# Altium project Lion-IRVT.PrjPcb (part 3 of 8)
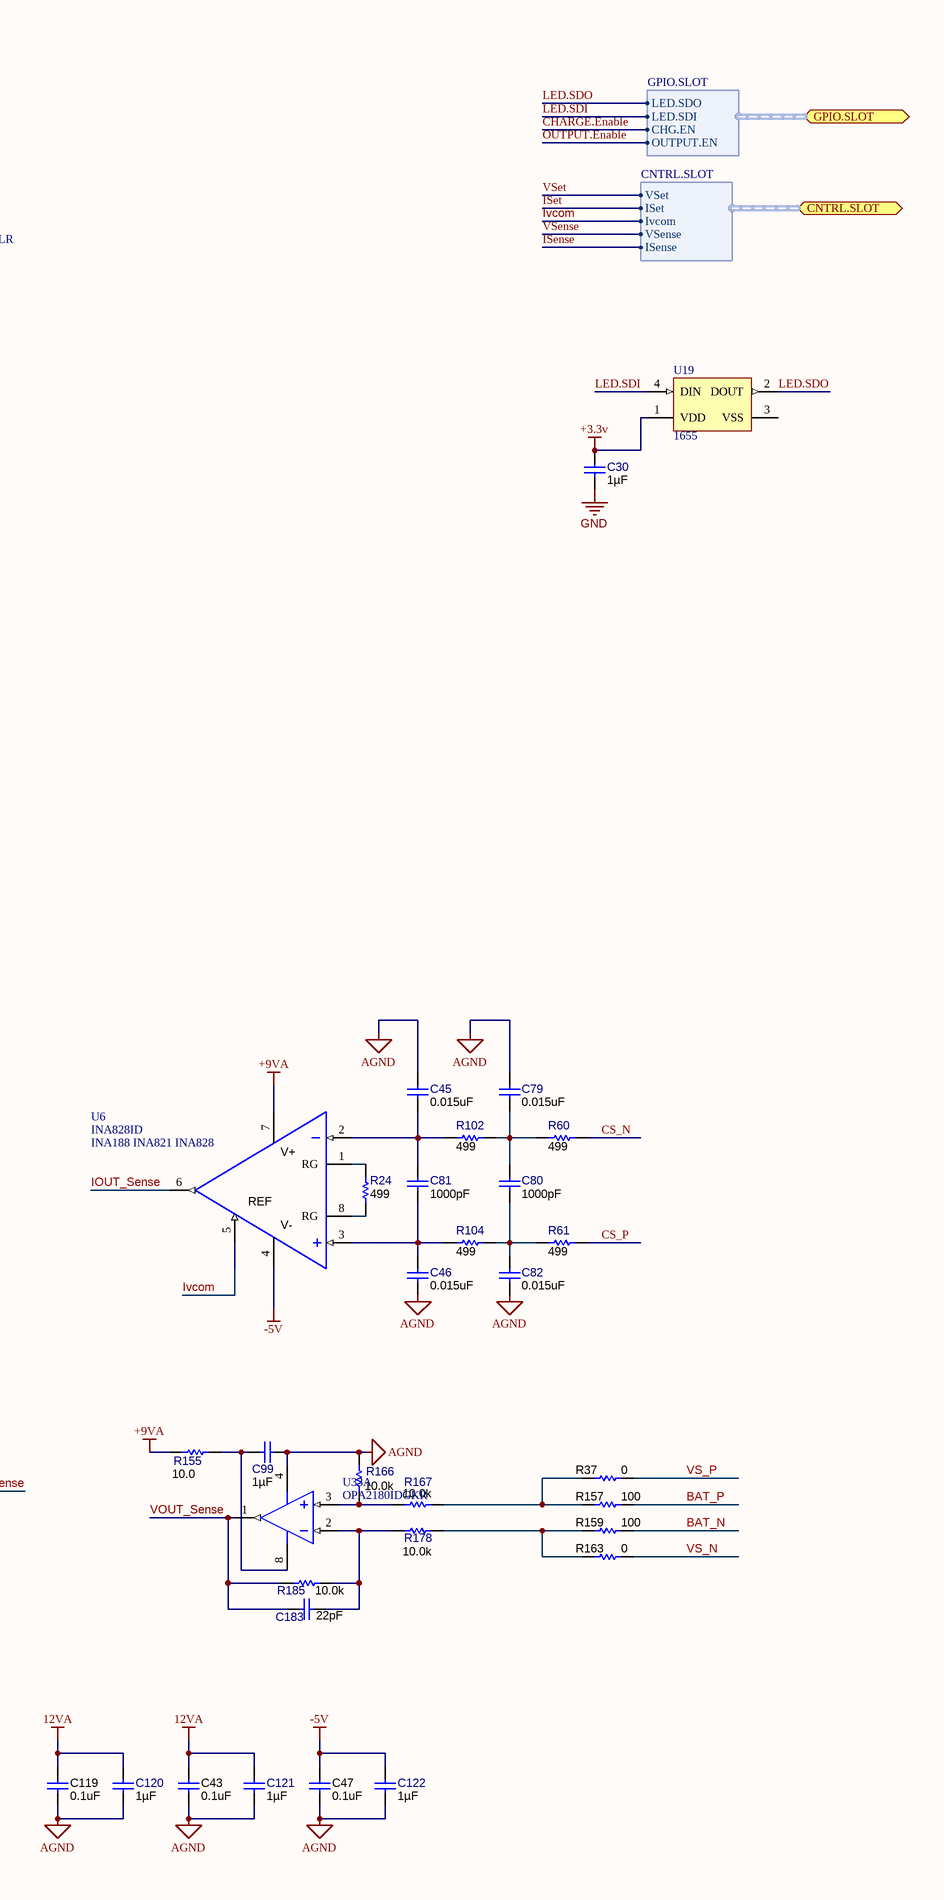
[diagram p103: LionIRVT-PMP40182.Control.SchDoc, right]

## Sheet LionIRVT-PMP40182.Control.SchDoc (continued)
### Library data of the parts
BN1 BP1 = ED555/2DS: Terminal Block, 6A, 3.5mm Pitch, 2-Pos, TH; Manufacturer: On-Shore Technology; SymbolCreator: a0412235; CompType: Connector; U/M: EA; SymbolVersion: 2013-03-14; PartNumber: ED555/2DS; RoHS: Y; PackageReference: 7.0x8.2x6.5mm; MountType: TH; ComponentLink1Description: Datasheet Link; ComponentLink1URL: http://on-shore.com/sites/default/files/manuals/ed555ds.pdf; Publisher: Texas Instruments; LatestRevisionDate: 2013-07-26; Supplier 1: Digi-Key; Supplier Part Number 1: ED1514-ND
C10 = 25SVPF330M: CAP, Aluminum Polymer, 330 µF, 25 V, +/- 20%, 0.014 ohm, F12, SMD, 2-Leads, Body 10.5x10.5mm, Height 12.7mm SMD; Manufacturer: Panasonic; Polarized: Y; CompType: Capacitor; Value: 330uF; U/M: EA; Cap_F: 0.00033; Tolerance_%: 20; VDC_V: 25; ESR_ohm: 0.014; IRMS_A: 5; TaMin_C: -55; TaMax_C: 105; SizeAreaWB_mm2: 151.29; SizeArea_mm2: 106.09; SizeX_mm: 10.3; SizeZ_mm: 12.6; AEC Category: Q200; AEC Qualified: N; SymbolVersion: 2008-07-09; PartNumber: 25SVPF330M; PackageReference: F12, SMD, 2-Leads, Body 10.5x10.5mm, Height 12.7mm; RoHS: Y; Value1: 0.014 ohm; MountType: SMT; Technology: Aluminum Polymer; Series: SVPF; Cap_Case: F12; SizeY_mm: 10.3; Publisher: Texas Instruments; LatestRevisionDate: 2016-12-22; ComponentLink1Description: Datasheet link; ComponentLink1URL: http://industrial.panasonic.com/www-data/pdf/AAB8000/AAB8000CE1.pdf; AEC Grade: N/A
C11 C12 = GRM32ER71E226KE15L: CAP, CERM, 22 µF, 25 V, +/- 10%, X7R, 1210; Manufacturer: MuRata; Polarized: N; CompType: Capacitor; Value: 22uF; U/M: EA; Cap_F: 0.000022; Tolerance_%: 10; Value1: Unknown; VDC_V: 25; TaMin_C: -55; TaMax_C: 125; Cap_Case: 1210; SizeArea_mm2: 8; SizeAreaWB_mm2: 14.7; SizeX_mm: 3.2; SizeY_mm: 2.5; SizeZ_mm: 2.7; AEC Category: Q200; SymbolVersion: 2008-07-09; PartNumber: GRM32ER71E226KE15L; PackageReference: 1210; RoHS: Y; MountType: SMT; Technology: Ceramic; TempCo: X7R; Published: 2008-06-19; Publisher: Texas Instruments; LatestRevisionDate: 2016-09-23; ComponentLink1Description: Datasheet link; ComponentLink1URL: http://search.murata.co.jp/Ceramy/PnsearchViewAction.do?HnOFG=ON&HnNFG=ON&SEL_CNT=50&sLang=en&sKey=GRM32ER71E226KE15L&x=9&y=9&search=startwith; Supplier 1: Digi-Key; Supplier Part Number 1: 490-5313-1-ND; Supplier 2: Mouser; Supplier Part Number 2: 81-GRM32ER71E226KE5L; Supplier 3: Farnell; Supplier Part Number 3: 1797019; AEC Qualified: ?
C17 C20 = GRM32ER71A476ME15L: CAP, CERM, 47 µF, 10 V, +/- 20%, X7R, 1210; Manufacturer: MuRata; Polarized: N; CompType: Capacitor; Value: 47uF; U/M: EA; Cap_F: 0.000047; Tolerance_%: 20; Value1: Unknown; VDC_V: 10; TaMin_C: -55; TaMax_C: 125; Cap_Case: 1210; SizeArea_mm2: 8; SizeAreaWB_mm2: 14.7; SizeX_mm: 3.2; SizeY_mm: 2.5; SizeZ_mm: 2.7; AEC Category: Q200; SymbolVersion: 2008-07-09; PartNumber: GRM32ER71A476ME15L; PackageReference: 1210; RoHS: Y; MountType: SMT; Technology: Ceramic; TempCo: X7R; Published: 2008-06-19; Publisher: Texas Instruments; LatestRevisionDate: 2016-09-23; ComponentLink1Description: Datasheet link; ComponentLink1URL: http://search.murata.co.jp/Ceramy/image/img/A01X/G101/ENG/GRM32ER71A476ME15-01.pdf; Supplier 1: Digi-Key; Supplier Part Number 1: 490-6543-1-ND; Supplier 2: Mouser; Supplier Part Number 2: 81-GRM32ER71A476ME5L; Supplier 3: Farnell; Supplier Part Number 3: 2362130; AEC Qualified: ?
C24 = 10SVP560M: CAP, Aluminum Polymer, 560 µF, 10 V, +/- 20%, 0.013 ohm, 10x10.3 SMD; Manufacturer: Panasonic; Polarized: Y; CompType: Capacitor; Value: 560uF; U/M: EA; Cap_F: 0.00056; Tolerance_%: 20; VDC_V: 10; ESR_ohm: 0.013; IRMS_A: 5.23; TaMin_C: -55; TaMax_C: 105; Cap_Case: 10.3x10.3x12.6; SizeAreaWB_mm2: 159.9; SizeArea_mm2: 113.3; SizeX_mm: 11; SizeY_mm: 10.3; SizeZ_mm: 7.7; AEC Category: Q200; SymbolVersion: 2008-07-09; PartNumber: 10SVP560M; PackageReference: 10x10.3; RoHS: Y; Value1: 0.013 ohm; MountType: SMT; Technology: Aluminum Polymer; Series: SVP; Publisher: Texas Instruments; LatestRevisionDate: 2016-09-20; ComponentLink1Description: Datasheet link; ComponentLink1URL: https://industrial.panasonic.com/content/data/CP/PDF/OS-CON/S_OS-CON_SVP_e.pdf; AEC Qualified: ?
C30 C85 C88 C97 C99 C101 C120-C122 C169 C171 = C0603C105K3RACTU: CAP, CERM, 1 µF, 25 V, +/- 10%, X7R, 0603; Manufacturer: Kemet; Polarized: N; CompType: Capacitor; Value: 1uF; U/M: EA; Cap_F: 0.000001; Tolerance_%: 10; Value1: Unknown; VDC_V: 25; Value2: 25V; TaMin_C: -55; TaMax_C: 125; Cap_Case: 0603; SizeArea_mm2: 1.28; SizeAreaWB_mm2: 4.68; SizeX_mm: 1.6; SizeY_mm: 0.8; SizeZ_mm: 1; AEC Category: Q200; SymbolVersion: 2008-07-09; PartNumber: C0603C105K3RACTU; PackageReference: 0603; RoHS: Y; MountType: SMT; Technology: Ceramic; TempCo: X7R; Published: 2008-06-19; Publisher: Texas Instruments; LatestRevisionDate: 2016-09-23; ComponentLink1Description: Datasheet link; ComponentLink1URL: http://capacitoredge.kemet.com/capedge2/DataSheet/Datasheet-C0603C105K3RACTU.pdf?pn=C0603C105K3RACTU; Supplier 1: Digi-Key; Supplier Part Number 1: 399-7376-1-ND; Supplier 2: Mouser; Supplier Part Number 2: 80-C0603C105K3R; Supplier 3: Farnell; Supplier Part Number 3: 2118128; AEC Qualified: ?
C43 C47 C56 C86 C119 C167 = CMP-0006752-5: CAP, CERM, 0.1 uF, 25 V, +/- 5%, X7R, 0603; PartNumber: 06033C104JAT2A; Manufacturer: AVX; Polarized: N; Value: 0.1uF; U/M: EA; Cap_F: 100nF; ESR_ohm: 0.05; Value1: 0.05 ohm; VDC_V: 25V; TaMin_C: -55°C; TaMax_C: 125°C; Cap_Case: 0603; AEC Category: Q200; SizeArea_mm2: 1.28; SizeAreaWB_mm2: 4.68; SizeX_mm: 1.6; SizeY_mm: 0.8; SizeZ_mm: 1; CompType: Capacitor; PackageReference: 0603; RoHS: Y; Tolerance_%: 5%; Value2: 25V; MountType: SMT; Technology: Ceramic; TempCo: X7R; Published: 2008-06-19; Publisher: Texas Instruments; LatestRevisionDate: 2017-03-09; ComponentLink1Description: Datasheet link; ComponentLink1URL: http://datasheets.avx.com/X7RDielectric.pdf; Supplier 1: Digi-Key; Supplier Part Number 1: 478-3713-1-ND; Supplier 2: Mouser; Supplier Part Number 2: 581-06033C104JAT2A; Supplier 3: Farnell; Supplier Part Number 3: 1740614; AEC Qualified: N; AEC Grade: N/A
C45 C46 C79-C82 = CMP-0007383-5: CAP, CERM, 0.015 uF, 16 V, +/- 10%, X7R, 0603; PartNumber: GRM188R71C153KA01D; Manufacturer: MuRata; Polarized: N; U/M: EA; Cap_F: 15nF; Value1: Unknown; VDC_V: 16V; TaMin_C: -55°C; TaMax_C: 125°C; Cap_Case: 0603; SizeArea_mm2: 1.28; SizeAreaWB_mm2: 4.68; SizeX_mm: 1.6; SizeY_mm: 0.8; SizeZ_mm: 1; AEC Category: Q200; CompType: Capacitor; Value: 0.015uF; PackageReference: 0603; RoHS: Y; Tolerance_%: 10%; Value2: 16V; MountType: SMT; Technology: Ceramic; TempCo: X7R; Published: 2008-06-19; Publisher: Texas Instruments; LatestRevisionDate: 2017-03-09; ComponentLink1Description: Datasheet link; ComponentLink1URL: http://search.murata.co.jp/Ceramy/PnsearchViewAction.do?HnOFG=ON&HnNFG=ON&SEL_CNT=50&sLang=en&sKey=GRM188R71C153KA01D&x=9&y=9&search=startwith; Supplier 1: Mouser; Supplier Part Number 1: 81-GRM188R71C153KA; AEC Qualified: ?
C48 = GRM319R61H475KA12: CAP, CERM, 4.7 µF, 50 V, +/- 10%, X5R, 1206; Manufacturer: MuRata; Polarized: N; CompType: Capacitor; Value: 4.7uF; U/M: EA; Cap_F: 0.0000047; Tolerance_%: 10; Value1: Unknown; VDC_V: 50; TaMin_C: -55; TaMax_C: 85; Cap_Case: 1206; SizeArea_mm2: 5.12; SizeAreaWB_mm2: 10.92; SizeX_mm: 3.2; SizeY_mm: 1.6; SizeZ_mm: 1.35; AEC Category: Q200; SymbolVersion: 2008-07-09; PartNumber: GRM319R61H475KA12; PackageReference: 1206; RoHS: Y; MountType: SMT; Technology: Ceramic; TempCo: X5R; Published: 2008-06-19; Publisher: Texas Instruments; LatestRevisionDate: 2016-09-23; ComponentLink1Description: Datasheet link; ComponentLink1URL: http://psearch.murata.com/capacitor/product/GRM319R61H475KA12%23.pdf; Supplier 1: Farnell; Supplier Part Number 1: 1845761; Supplier 2: Newark; Supplier Part Number 2: 13T1225; AEC Qualified: ?
C55 C89-C91 C95 C96 C100 C166 = GRM1885C1H101JA01D: CAP, CERM, 100 pF, 50 V, +/- 5%, C0G/NP0, 0603; Manufacturer: MuRata; Polarized: N; CompType: Capacitor; Value: 100pF; U/M: EA; Cap_F: 0.0000000001; Tolerance_%: 5; Value1: Unknown; VDC_V: 50; Value2: 50V; TaMin_C: -55; TaMax_C: 125; Cap_Case: 0603; SizeArea_mm2: 1.28; SizeAreaWB_mm2: 4.68; SizeX_mm: 1.6; SizeY_mm: 0.8; SizeZ_mm: 1; AEC Category: Q200; SymbolVersion: 2008-07-09; PartNumber: GRM1885C1H101JA01D; PackageReference: 0603; RoHS: Y; MountType: SMT; Technology: Ceramic; TempCo: C0G/NP0; Published: 2008-06-19; Publisher: Texas Instruments; ComponentLink1Description: Datasheet link; ComponentLink1URL: http://search.murata.co.jp/Ceramy/PnsearchViewAction.do?HnOFG=ON&HnNFG=ON&SEL_CNT=50&sLang=en&sKey=GRM1885C1H101JA01D&x=9&y=9&search=startwith; Supplier 1: Digi-Key; Supplier Part Number 1: 490-1427-1-ND; Supplier 2: Mouser; Supplier Part Number 2: 81-GRM39C101J50; Supplier 3: Farnell; Supplier Part Number 3: 8819866; AEC Qualified: ?
  C55 C89-C91 C95 C96 C100: LatestRevisionDate: 2016-09-23
  C166: LatestRevisionDate: 2016-12-20
C74 C168 C177 = GRM1885C1H103JA01D: CAP, CERM, 0.01 µF, 50 V, +/- 5%, C0G/NP0, 0603; Manufacturer: MuRata; Polarized: N; CompType: Capacitor; Value: 0.01uF; U/M: EA; Cap_F: 0.00000001; Tolerance_%: 5; Value1: Unknown; VDC_V: 50; Value2: 50V; TaMin_C: -55; TaMax_C: 125; Cap_Case: 0603; SizeArea_mm2: 1.28; SizeAreaWB_mm2: 4.68; SizeX_mm: 1.6; SizeY_mm: 0.8; SizeZ_mm: 1; AEC Category: Q200; SymbolVersion: 2008-07-09; PartNumber: GRM1885C1H103JA01D; PackageReference: 0603; RoHS: Y; MountType: SMT; Technology: Ceramic; TempCo: C0G/NP0; Published: 2008-06-19; Publisher: Texas Instruments; LatestRevisionDate: 2017-03-17; ComponentLink1Description: Datasheet link; ComponentLink1URL: http://search.murata.co.jp/Ceramy/image/img/A01X/G101/ENG/GRM1885C1H103JA01-01.pdf; Supplier 1: Digi-Key; Supplier Part Number 1: 490-9666-1-ND; Supplier 2: Newark; Supplier Part Number 2: 31Y1764; Supplier 3: Mouser; Supplier Part Number 3: 81-GRM1885C1H103JA1D; AEC Qualified: N; AEC Grade: N/A
C87 = GRM1885C1H102JA01D: CAP, CERM, 1000 pF, 50 V, +/- 5%, C0G/NP0, 0603; Manufacturer: MuRata; Polarized: N; CompType: Capacitor; Value: 1000pF; U/M: EA; Cap_F: 0.000000001; Tolerance_%: 5; Value1: Unknown; VDC_V: 50; Value2: 50V; TaMin_C: -55; TaMax_C: 125; Cap_Case: 0603; SizeArea_mm2: 1.28; SizeAreaWB_mm2: 4.68; SizeX_mm: 1.6; SizeY_mm: 0.8; SizeZ_mm: 1; AEC Category: Q200; SymbolVersion: 2008-07-09; PartNumber: GRM1885C1H102JA01D; PackageReference: 0603; RoHS: Y; MountType: SMT; Technology: Ceramic; TempCo: C0G/NP0; Published: 2008-06-19; Publisher: Texas Instruments; LatestRevisionDate: 2016-09-23; ComponentLink1Description: Datasheet link; ComponentLink1URL: http://search.murata.co.jp/Ceramy/PnsearchViewAction.do?HnOFG=ON&HnNFG=ON&SEL_CNT=50&sLang=en&sKey=GRM1885C1H102JA01D&x=9&y=9&search=startwith; Supplier 1: Digi-Key; Supplier Part Number 1: 490-1451-1-ND; Supplier 2: Mouser; Supplier Part Number 2: 81-GRM39C102J50; Supplier 3: Farnell; Supplier Part Number 3: 8819920; AEC Qualified: ?
C92 = GRM188R71A225KE15D: CAP, CERM, 2.2 µF, 10 V, +/- 10%, X7R, 0603; Manufacturer: MuRata; Polarized: N; CompType: Capacitor; Value: 2.2uF; U/M: EA; Cap_F: 0.0000022; Tolerance_%: 10; ESR_ohm: 0.009; Value1: 0.009 ohm; Value2: 10V; TaMin_C: -55; TaMax_C: 125; Cap_Case: 0603; SizeArea_mm2: 1.28; SizeAreaWB_mm2: 4.68; SizeX_mm: 1.6; SizeY_mm: 0.8; SizeZ_mm: 1; AEC Category: Q200; SymbolVersion: 2008-07-09; PartNumber: GRM188R71A225KE15D; PackageReference: 0603; RoHS: Y; VDC_V: 10; MountType: SMT; Technology: Ceramic; TempCo: X7R; Published: 2008-06-19; Publisher: Texas Instruments; LatestRevisionDate: 2017-03-17; ComponentLink1Description: Datasheet link; ComponentLink1URL: http://search.murata.co.jp/Ceramy/PnsearchViewAction.do?HnOFG=ON&HnNFG=ON&SEL_CNT=50&sLang=en&sKey=GRM188R71A225KE15D&x=9&y=9&search=startwith; Supplier 1: Digi-Key; Supplier Part Number 1: 490-4520-1-ND; Supplier 2: Mouser; Supplier Part Number 2: 81-GRM188R71A225KE15; Supplier 3: Farnell; Supplier Part Number 3: 1797012; AEC Qualified: ?
C93 C170 = GRM1885C1H221JA01D: CAP, CERM, 220 pF, 50 V, +/- 5%, C0G/NP0, 0603; Manufacturer: MuRata; Polarized: N; CompType: Capacitor; Value: 220pF; U/M: EA; Cap_F: 0.00000000022; Tolerance_%: 5; Value1: Unknown; VDC_V: 50; Value2: 50V; TaMin_C: -55; TaMax_C: 125; Cap_Case: 0603; SizeArea_mm2: 1.28; SizeAreaWB_mm2: 4.68; SizeX_mm: 1.6; SizeY_mm: 0.8; SizeZ_mm: 1; AEC Category: Q200; SymbolVersion: 2008-07-09; PartNumber: GRM1885C1H221JA01D; PackageReference: 0603; RoHS: Y; MountType: SMT; Technology: Ceramic; TempCo: C0G/NP0; Published: 2008-06-19; Publisher: Texas Instruments; ComponentLink1Description: Datasheet link; ComponentLink1URL: http://search.murata.co.jp/Ceramy/PnsearchViewAction.do?HnOFG=ON&HnNFG=ON&SEL_CNT=50&sLang=en&sKey=GRM1885C1H221JA01D&x=9&y=9&search=startwith; Supplier 1: Digi-Key; Supplier Part Number 1: 490-1435-1-ND; Supplier 2: Mouser; Supplier Part Number 2: 81-GRM39C221J50; Supplier 3: Farnell; Supplier Part Number 3: 8819882; AEC Qualified: ?
  C93: LatestRevisionDate: 2017-03-10
  C170: LatestRevisionDate: 2017-03-17
C98 = C0603C104J3RACTU: CAP, CERM, 0.1 µF, 25 V, +/- 5%, X7R, 0603; Manufacturer: Kemet; Polarized: N; CompType: Capacitor; Value: 0.1uF; U/M: EA; Cap_F: 0.0000001; Tolerance_%: 5; Value1: Unknown; VDC_V: 25; Value2: 25V; TaMin_C: -55; TaMax_C: 125; Cap_Case: 0603; SizeArea_mm2: 1.28; SizeAreaWB_mm2: 4.68; SizeX_mm: 1.6; SizeY_mm: 0.8; SizeZ_mm: 1; AEC Category: Q200; SymbolVersion: 2008-07-09; PartNumber: C0603C104J3RACTU; PackageReference: 0603; RoHS: Y; MountType: SMT; Technology: Ceramic; TempCo: X7R; Published: 2008-06-19; Publisher: Texas Instruments; LatestRevisionDate: 2016-09-23; ComponentLink1Description: Datasheet link; ComponentLink1URL: http://www.kemet.com/kemet/web/homepage/kechome.nsf/vapubfiles/F3102_Y5V.pdf/$file/F3102_Y5V.pdf; Supplier 1: Digi-Key; Supplier Part Number 1: 399-1282-1-ND; Supplier 2: Mouser; Supplier Part Number 2: 80-C0603C104J3R; Supplier 3: Farnell; Supplier Part Number 3: 1650833; AEC Qualified: ?
C118 = GRM188R71A334KA61D: CAP, CERM, 0.33 µF, 10 V, +/- 10%, X7R, 0603; Manufacturer: MuRata; Polarized: N; CompType: Capacitor; Value: 0.33uF; U/M: EA; Cap_F: 0.00000033; Tolerance_%: 10; Value1: Unknown; Value2: 10V; TaMin_C: -55; TaMax_C: 125; Cap_Case: 0603; SizeArea_mm2: 1.28; SizeAreaWB_mm2: 4.68; SizeX_mm: 1.6; SizeY_mm: 0.8; SizeZ_mm: 1; AEC Category: Q200; SymbolVersion: 2008-07-09; PartNumber: GRM188R71A334KA61D; PackageReference: 0603; RoHS: Y; VDC_V: 10; MountType: SMT; Technology: Ceramic; TempCo: X7R; Published: 2008-06-19; Publisher: Texas Instruments; LatestRevisionDate: 2017-03-17; ComponentLink1Description: Datasheet link; ComponentLink1URL: http://search.murata.co.jp/Ceramy/PnsearchViewAction.do?HnOFG=ON&HnNFG=ON&SEL_CNT=50&sLang=en&sKey=GRM188R71A334KA61D&x=9&y=9&search=startwith; Supplier 1: Digi-Key; Supplier Part Number 1: GRM188R71A334KA61D-ND; Supplier 2: Mouser; Supplier Part Number 2: 81-GRM188R71A334KA1D; AEC Qualified: ?
C124 = CMP-03020-023900-1: CAP CER 1500PF 100V NP0 0603; Manufacturer: KEMET; Material: Ceramic; Automotive Grade: Grade 1; Temperature Characteristic: C0G; Value: 1,500 pF; Tolerance: 0.05; Temperature Coefficient: 30ppm/°C; Manufacturer Part Number: C0603C152J1GACTU; ComponentLink2URL: https://api.kemet.com/component-edge/download/datasheet/C0603C100J5GACAUTO.pdf; ComponentLink2Description: Datasheet; Package: C0603C-CF; Octopart: https://octopart.com/c0603c152j1gactu-kemet-12793172; Lead Free: Yes; Temperature Range Low: -55°C; Digikey Description: CAP CER 1500PF 100V NP0 0603; Height: 0.87mm; Device Class L1: Passive Components; Mouser Description: Cap Ceramic 0.0015uF 100V C0G 5% SMD 0603 125°C Paper T/R; Voltage Rating: 100 V; Device Class L2: Capacitors; Category: Cap; Device Class L3: Ceramic Capacitors; Automotive: Yes; Temperature: -55°C to +125°C; Temperature Range High: +125°C; RoHS: TRUE
C183 = C0603C220J5GACTU: CAP, CERM, 22 pF, 50 V, +/- 5%, C0G/NP0, 0603; Manufacturer: Kemet; Polarized: N; CompType: Capacitor; Value: 22pF; U/M: EA; Cap_F: 0.000000000022; Tolerance_%: 5; Value1: Unknown; VDC_V: 50; Value2: 50V; TaMin_C: -55; TaMax_C: 125; Cap_Case: 0603; SizeArea_mm2: 1.28; SizeAreaWB_mm2: 4.68; SizeX_mm: 1.6; SizeY_mm: 0.8; SizeZ_mm: 1; AEC Category: Q200; SymbolVersion: 2008-07-09; PartNumber: C0603C220J5GACTU; PackageReference: 0603; RoHS: Y; MountType: SMT; Technology: Ceramic; TempCo: C0G/NP0; Published: 2008-06-19; Publisher: Texas Instruments; LatestRevisionDate: 2016-09-23; ComponentLink1Description: Datasheet link; ComponentLink1URL: http://www.kemet.com/kemet/web/homepage/kechome.nsf/vapubfiles/F3102_Y5V.pdf/$file/F3102_Y5V.pdf; Supplier 1: Digi-Key; Supplier Part Number 1: 399-1053-1-ND; Supplier 2: Mouser; Supplier Part Number 2: 80-C0603C220J5G; Supplier 3: Farnell; Supplier Part Number 3: 1414622; AEC Qualified: ?
D1 D7 = MBR140SFT1G: Diode, Schottky, 40 V, 1 A, SOD-123FL; Manufacturer: ON Semiconductor; U/M: EA; Vf_V: 0.55; Value: 40V; Value1: 1A; Value2: 0.55V; Io_A: 1; Vr_V: 40; TJmax_C: 125; RJC_CperW: 26; SizeAreaWB_mm2: 12.19; SizeArea_mm2: 5.94; SizeX_mm: 3.6; SizeY_mm: 1.65; SizeZ_mm: 0.98; AEC Category: Q101; SymbolVersion: 2008-12-08; PartNumber: MBR140SFT1G; PackageReference: SOD-123FL; CompType: Diode; MountType: SMT; Type: Schottky; RoHS: Y; Published: 2008-06-26; Publisher: Texas Instruments; LatestRevisionDate: 2016-12-16; ComponentLink1Description: Datasheet link; ComponentLink1URL: http://www.onsemi.com/pub_link/Collateral/MBR140SFT1-D.PDF; Supplier 1: Digi-Key; Supplier Part Number 1: MBR140SFT1GOSCT-ND; Supplier 2: Mouser; Supplier Part Number 2: 863-MBR140SFT1G; Supplier 3: Farnell; Supplier Part Number 3: 1431046; AEC Qualified: ?
D2 D8-D12 D16-D18 = NSR0240V2T1G: Diode, Schottky, 40V, 0.25A, SOD-523; Manufacturer: ON Semiconductor; U/M: EA; Vf_V: 0.7; Value2: 0.7V; Io_A: 0.25; Vr_V: 40; TJmax_C: 150; RJC_CperW: 600; CompType: Diode; SymbolVersion: 2008-12-08; PartNumber: NSR0240V2T1G; PackageReference: SOD-523; Value: 40V; Value1: 0.25A; MountType: SMT; Type: Schottky; RoHS: Y; Published: 2008-06-26; Publisher: Texas Instruments; LatestRevisionDate: 2014-07-21; ComponentLink1Description: Datasheet link; ComponentLink1URL: http://www.onsemi.com/pub_link/Collateral/NSR0240V2T1-D.PDF; Supplier 1: Digi-Key; Supplier Part Number 1: NSR0240V2T1GOSCT-ND; Supplier 2: Mouser; Supplier Part Number 2: 863-NSR0240V2T1G; Supplier 3: Newark; Supplier Part Number 3: 46P8323
D4 D5 = MMSZ5245BS-7-F: Diode, Zener, 15 V, 200 mW, SOD-323; Manufacturer: Diodes Inc.; SymbolCreator: a0412235; U/M: EA; Power_W: 0.2; Vz_V: 15; Value1: 0.2W; RJA_CperW: 350; SizeAreaWB_mm2: 8.695; SizeArea_mm2: 3.645; SizeX_mm: 2.7; SizeY_mm: 1.35; SizeZ_mm: 1; AEC Category: Q101; SymbolVersion: 2010-08-25; PartNumber: MMSZ5245BS-7-F; PackageReference: SOD-323; CompType: Zener; Vr_V: N/A; MountType: SMT; RoHS: Y; ComponentLink1Description: Datasheet link; ComponentLink1URL: http://www.diodes.com/datasheets/ds31038.pdf; Published: 2008-10-08; Publisher: Texas Instruments; LatestRevisionDate: 2017-03-18; LatestRevisionNote: Updated Supplier Data; Supplier 1: Digi-Key; Supplier Part Number 1: MMSZ5245BS-FDICT-ND; Supplier 2: Mouser; Supplier Part Number 2: 621-MMSZ5245BS-F; AEC Qualified: ?
D15 = MMSZ5233BS-7-F: Diode, Zener, 6 V, 200 mW, SOD-323; Manufacturer: Diodes Inc.; U/M: EA; Value1: 0.2W; SymbolCreator: a0412235; Power_W: 0.2; Vz_V: 6; RJA_CperW: 350; SizeAreaWB_mm2: 8.695; SizeArea_mm2: 3.645; SizeX_mm: 2.7; SizeY_mm: 1.35; SizeZ_mm: 1; AEC Category: Q101; CompType: Zener; SymbolVersion: 2010-08-25; PartNumber: MMSZ5233BS-7-F; PackageReference: SOD-323; Value: 6V; Vr_V: N/A; MountType: SMT; RoHS: Y; Published: 2008-10-08; Publisher: Texas Instruments; LatestRevisionDate: 2017-03-18; ComponentLink1Description: Datasheet link; ComponentLink1URL: http://www.diodes.com/datasheets/ds31038.pdf; Supplier 1: Digi-Key; Supplier Part Number 1: MMSZ5233BS-FDICT-ND; Supplier 2: Mouser; Supplier Part Number 2: 621-MMSZ5233BS-7-F; LatestRevisionNote: Updated Supplier Data; AEC Qualified: ?
F1 = FUSE_CCF1N_SERIES: Fuse, Fast Acting, 50VDC, 20A; Manufacturer: Koanet; Area: 46035; Value: LH-10; ComponentLink1URL: \\vette02\pmp_pcb\pcad_pdf's\ccf_fuse.pdf; ComponentHeight: 0.098 inch; PackageReference: 0.98 x 0.236 inch; SymbolVersion: 07/31/2009 12:17:29; PartNumber: CCF1N15; ComponentLink1Description: AEO Datasheet Link
L4 = CMP-0226-00120-1: SMD High Current Cube Inductor WE-HCC, L=3.30 µH; Inductance: 3.30 ÂµH; ComponentLink1URL: http://www.we-online.com; PackageVersion: 2009; DatasheetVersion: ver 2, Nov-2009; ComponentLink2Description: Datasheet; PackageDescription: Inductor, 2-Leads, Body 12.1 x 11.4 mm; ComponentLink2URL: http://www.we-online.de/katalog/media/pdf/7443320330.pdf; ComponentLink1Description: Manufacturer Link; PackageReference: WE-HCC-1210
Q4 Q5 = CSD16570Q5B: 25V, N ch NexFET MOSFET™, single SON5x6, 0.82mOhm; Manufacturer: Texas Instruments; Manufacturer Part Number: CSD16570Q5BT; CompType: MOSFET; Continuous Drain Current (ID): 100A; Rds On Max: 0.59mR; Input Capacitance: 14nF; Max Power Dissipation: 195W; Gate to Source Voltage (Vgs): 20V; Fall Time: 72ns; Rise Time: 43ns; Turn-Off Delay Time: 156ns; Turn-On Delay Time: 5ns; Threshold Voltage: 1.5V; Number of Channels: 1; SymbolVersion: 2008-07-09; Value: 25V; PartNumber: CSD16570Q5B; PackageReference: DNK0008A; ComponentLink1Description: Datasheet link; ComponentLink1URL: http://www.ti.com/lit/ds/symlink/csd17308q3.pdf; Supplier 1: Digi-Key; RoHS: Yes; Category: MOSFETs; Stock 1: 3774; Pricing 1: 1=2.43000, 10=2.18600, 25=2.06240, 100=1.60880 (USD); Mount: Surface Mount; Number of Pins: 8; Weight: 0.000847oz; Contact Plating: Gold; Min Operating Temperature: -55°C; Max Operating Temperature: 150°C; Packaging: Tape and Reel; Drain to Source Voltage (Vdss): 25V; Element Configuration: Single; Drain to Source Breakdown Voltage: 25V; Package Quantity: 250; Lead Free: Contains Lead; REACH SVHC: No SVHC; ComponentLink2URL: http://www.farnell.com/datasheets/1874868.pdf?src-supplier=Farnell; ComponentLink2Description: http://www.farnell.com/datasheets/1874868.pdf?src-supplier=Farnell; ComponentLink3URL: http://www.farnell.com/datasheets/2026550.pdf?src-supplier=Element14; ComponentLink3Description: http://www.farnell.com/datasheets/2026550.pdf?src-supplier=Element14; ComponentLink4URL: http://www.ti.com/lit/ds/symlink/csd16570q5b.pdf?src-supplier=Digi-Key; ComponentLink4Description: http://www.ti.com/lit/ds/symlink/csd16570q5b.pdf?src-supplier=Digi-Key; ComponentLink5URL: http://www.ti.com/general/docs/lit/getliterature.tsp?genericPartNumber=CSD16570Q5B&fileType=pdf&src-supplier=Farnell; ComponentLink5Description: http://www.ti.com/general/docs/lit/getliterature.tsp?genericPartNumber=CSD16570Q5B&fileType=pdf&src-supplier=Farnell; ComponentLink6URL: http://www.ti.com/general/docs/lit/getliterature.tsp?genericPartNumber=CSD16570Q5B&&fileType=pdf&src-supplier=Avnet; ComponentLink6Description: http://www.ti.com/general/docs/lit/getliterature.tsp?genericPartNumber=CSD16570Q5B&&fileType=pdf&src-supplier=Avnet; ComponentLink7URL: http://www.farnell.com/datasheets/1874868.pdf?src-supplier=Element14; ComponentLink7Description: http://www.farnell.com/datasheets/1874868.pdf?src-supplier=Element14; ComponentLink8URL: http://www.ti.com/lit/gpn/csd16570q5b?src-supplier=Mouser; ComponentLink8Description: http://www.ti.com/lit/gpn/csd16570q5b?src-supplier=Mouser; Supplier Part Number 1: 296-38335-1-ND
Q6 Q9 = CSD18502Q5B: 40V, N ch NexFET MOSFET™, single SON5x6, 2.3mOhm; Manufacturer: Texas Instruments; CompType: MOSFET; Rise Time: 6.8ns; Continuous Drain Current (ID): 100A; Fall Time: 4ns; Gate to Source Voltage (Vgs): 20V; Turn-Off Delay Time: 23ns; Turn-On Delay Time: 5.3ns; Rds On Max: 2.3mR; Input Capacitance: 5.07nF; Power Dissipation: 3.2W; Drain to Source Resistance: 2.5mR; Threshold Voltage: 1.8V; Number of Elements: 1; SymbolVersion: 2008-07-09; Value: 40V; PartNumber: CSD18502Q5B; PackageReference: DNK0008A; ComponentLink1Description: Datasheet link; ComponentLink1URL: http://www.ti.com/lit/ds/symlink/csd17308q3.pdf; Supplier 1: Digi-Key; Manufacturer Part Number: CSD18502Q5B; RoHS: Yes; Category: Integrated Circuits (ICs); Stock 1: 29285; Pricing 1: 1=2.37000, 10=2.13300, 25=2.01240, 100=1.56980, 500=1.32826, 1000=1.12700 (USD); Mount: Surface Mount; Number of Pins: 8; Contact Plating: Tin,Matte; Min Operating Temperature: -55°C; Max Operating Temperature: 150°C; Element Configuration: Single; Packaging: Tape and Reel; Package Quantity: 1; Drain to Source Breakdown Voltage: 40V; Drain to Source Voltage (Vdss): 40V; Max Power Dissipation: 3.2W; Length: 6.1mm; Height: 1.05mm; Width: 5.1mm; Radiation Hardening: No; Lead Free: Contains Lead; REACH SVHC: No SVHC; ComponentLink2URL: https://datasheet.ciiva.com/14192/csd18502q5b-14192916.pdf?src-supplier=Avnet; ComponentLink2Description: https://datasheet.ciiva.com/14192/csd18502q5b-14192916.pdf?src-supplier=Avnet; ComponentLink3URL: https://datasheet.ciiva.com/14423/csd18502q5b-14423447.pdf?src-supplier=Avnet; ComponentLink3Description: https://datasheet.ciiva.com/14423/csd18502q5b-14423447.pdf?src-supplier=Avnet; ComponentLink4URL: https://datasheet.ciiva.com/6386/csd18502q5b-6386070.pdf?src-supplier=Digi-Key; ComponentLink4Description: https://datasheet.ciiva.com/6386/csd18502q5b-6386070.pdf?src-supplier=Digi-Key; ComponentLink5URL: https://datasheet.ciiva.com/6386/csd18502q5b-6386071.pdf?src-supplier=Digi-Key; ComponentLink5Description: https://datasheet.ciiva.com/6386/csd18502q5b-6386071.pdf?src-supplier=Digi-Key; ComponentLink6URL: https://datasheet.ciiva.com/6386/csd18502q5b-6386072.pdf?src-supplier=Digi-Key; ComponentLink6Description: https://datasheet.ciiva.com/6386/csd18502q5b-6386072.pdf?src-supplier=Digi-Key; Supplier Part Number 1: 296-35629-1-ND
Q8 = CMP-1048-00538-1: General Purpose Transistor, NPN Silicon, 3-Pin SOT-23, Pb-Free, Tape and Reel; Manufacturer: On Semiconductor; fT Min (MHz): 300; IC Continuous (A): 0.6; ComponentLink3URL: http://www.onsemi.cn/pub_link/Collateral/318-08.PDF; PartNumber: MMBT2222ALT1G; RoHS: TRUE; ComponentLink1URL: http://www.onsemi.com/; ComponentLink3Description: Package Specification; ComponentLink2Description: Datasheet; Mounting Technology: Surface Mount; Packing: Tape and Reel; PackageDescription: 3-Pin Small Outline Transistor, Body 2.92 x 1.3 mm, Pitch 0.95 mm; DatasheetVersion: Rev. 10; PackageReference: SOT-23-3-318-08; ComponentLink2URL: http://www.onsemi.cn/pub_link/Collateral/MMBT2222LT1-D.PDF; Polarity: NPN; PackageVersion: Rev. AP, 11/2009; ComponentLink1Description: Manufacturer URL
Q10 = CMP-2000-04929-1: N-Channel Enhancement Mode Field Effect Transistor, 60 V, 0.115 A, -55 to 150 degC, 3-Pin SOT23, RoHS, Tape and Reel; Id - Continuous Drain Current: 115mA; Typical Turn-On Delay Time: 7ns; Typical Turn-Off Delay Time: 11ns; Brand: DiodesIncorporated; Transistor Type: 1N-Channel; Vgs - Gate-Source Voltage: 20V; Rise Time: 3ns; Configuration: Single; Fall Time: 5.6ns; Vds - Drain-Source Breakdown Voltage: 70V; Rds On - Drain-Source Resistance: 7.5Ohms; Number of Channels: 1Channel; Forward Transconductance - Min: 0.08S; Pd - Power Dissipation: 300mW; Unit Weight: 0.000282oz; Datasheet URL: http://datasheet.octopart.com/2N7002-7-F-Diodes-Inc.-datasheet-8326113.pdf; Width: 1.3mm; Series: 2N7002; Length: 2.9mm; Product Category: MOSFET; Minimum Operating Temperature: -55C; Manufacturer URL: http://www.diodes.com/; Mounting Style: SMD/SMT; Package Reference: SOT23-3; Package Description: 3-Pin Small Outline Transistor, Body 2.9 x 1.3 mm, Pitch 0.96 mm; Maximum Operating Temperature: +150C; Transistor Polarity: N-Channel; Factory Pack Quantity: 3000; Technology: Si; Channel Mode: Enhancement; Datasheet Version: Rev. 21-2, 02/2009; Type: EnhancementModeFieldEffectTransistor; RoHS: True; Packaging: Reel; Package / Case: SOT-23-3; Height: 1mm; Product: MOSFETSmallSignal; Manufacturer: DiodesIncorporated
R7 R34 R39 R42 R44 R64-R67 R74 R75 R77 R86 R89 R90 R93 R94 R100 R103 R166 R167 R175 R178 R185 = RC0603FR-0710KL: RES, 10.0 k, 1%, 0.1 W, 0603; Manufacturer: Yageo America; CompType: Resistor; Value: 10.0k; Res_ohm: 10000; Value_Code: 10k0; Tolerance_%: 1; Power_W: 0.1; Value2: 0.1W; VDC_V: 150; TempCo: 200 ppm/C; SizeArea_mm2: 1.28; SizeX_mm: 1.6; SizeY_mm: 0.8; EIA_Code: E96; U/M: EA; AEC Category: Q200; SymbolVersion: 2009-05-29; PartNumber: RC0603FR-0710KL; PackageReference: 0603; RoHS: Y; Value1: 1%; MountType: SMT; Technology: Thick Film; SizeZ_mm: 1; Published: 2008-06-26; Publisher: Texas Instruments; ComponentLink1Description: Datasheet link; ComponentLink1URL: http://www.yageo.com/pdf/Pu-RC0603_51_PbFree_L_2.pdf; Supplier 1: Digi-Key; Supplier Part Number 1: 311-10.0KHRCT-ND; Supplier 2: Mouser; Supplier Part Number 2: 603-RC0603FR-0710KL; Supplier 3: Farnell; Supplier Part Number 3: 9238603; AEC Qualified: ?
  R7 R67 R74 R75 R77 R86 R89 R90 R93 R94 R100 R103 R166 R167 R175 R178 R185: LatestRevisionDate: 2016-09-18
  R34 R39 R42 R44 R64-R66: LatestRevisionDate: 2017-03-04
R8 = CMP-0021990-4: RES, 100 k, 1%, 0.1 W, AEC-Q200 Grade 0, 0603; PartNumber: CRCW0603100KFKEA; Manufacturer: Vishay-Dale; Value: 100k; Power_W: 100mW; Value2: 0.1W; VDC_V: 75V; TempCo: 100 ppm/C; EIA_Code: E96; AEC Category: Q200; AEC Qualified: Y; AEC Grade: 0; SizeArea_mm2: 1.28; SizeX_mm: 1.6; SizeY_mm: 0.8; SizeZ_mm: 1; CompType: Resistor; PackageReference: 0603; RoHS: E; Res_ohm: 100k; Value_Code: 100k; Tolerance_%: 1%; Value1: 1%; MountType: SMT; Technology: Thick Film; ComponentLink1Description: Datasheet link; ComponentLink1URL: http://www.vishay.com/docs/20035/dcrcwe3.pdf; Supplier 1: Digi-Key; Supplier Part Number 1: 541-100KHCT-ND; Supplier 2: Newark; Supplier Part Number 2: 42K3668; Supplier 3: Mouser; Supplier Part Number 3: 71-CRCW0603-100K-E3
R24 = RC0603FR-07499RL: RES, 499, 1%, 0.1 W, 0603; Manufacturer: Yageo America; CompType: Resistor; Value: 499; Value_Code: 499R; Tolerance_%: 1; Power_W: 0.1; Value2: 0.1W; VDC_V: 150; TempCo: 200 ppm/C; SizeArea_mm2: 1.28; SizeX_mm: 1.6; SizeY_mm: 0.8; EIA_Code: E96; U/M: EA; AEC Category: Q200; Green_Lifecycle: Active; Green_REACh: Passed; SymbolVersion: 2009-05-29; PartNumber: RC0603FR-07499RL; PackageReference: 0603; RoHS: Y; Res_ohm: 499; Value1: 1%; MountType: SMT; Technology: Thick Film; SizeZ_mm: 1; Published: 2008-06-26; Publisher: Texas Instruments; LatestRevisionDate: 2017-05-31; ComponentLink1Description: Datasheet link; ComponentLink1URL: http://www.yageo.com/pdf/Pu-RC0603_51_PbFree_L_2.pdf; Supplier 1: Digi-Key; Supplier Part Number 1: 311-499HRCT-ND; Supplier 2: Mouser; Supplier Part Number 2: 603-RC0603FR-07499RL; Supplier 3: Farnell; Supplier Part Number 3: 1799347; AEC Qualified: ?; Green_EU RoHS: Passed with Exemption; Green_EU RoHS-2: Passed
R28 R37 R163 = Resistor: RES, 0, 5%, 0.1 W, 0603; PartNumber: ERJ-3GEY0R00V; Manufacturer: Panasonic; Value: 0; Value_Code: 0000; Power_W: 100mW; Value2: 0.1W; VDC_V: 50V; TempCo: 600 ppm/C; EIA_Code: E24; U/M: EA; AEC Category: Q200; SizeArea_mm2: 1.28; SizeX_mm: 1.6; SizeY_mm: 0.8; SizeZ_mm: 1; CompType: Resistor; PackageReference: 0603; RoHS: Y; Res_ohm: 0; Tolerance_%: 5%; Value1: 5%; MountType: SMT; Technology: Thick Film; Published: 2008-06-26; Publisher: Texas Instruments; LatestRevisionDate: 2017-03-09; ComponentLink1Description: Datasheet link; ComponentLink1URL: http://www.panasonic.com/industrial/components/pdf/AOA0000CE1.pdf; Supplier 1: Digi-Key; Supplier Part Number 1: P0.0GCT-ND; Supplier 2: Mouser; Supplier Part Number 2: 667-ERJ-3GEY0R00V; Supplier 3: Farnell; Supplier Part Number 3: 2059527; AEC Qualified: ?
R29 = RC1206FR-0710RL: RES, 10.0, 1%, 0.25 W, 1206; Manufacturer: Yageo America; CompType: Resistor; Value: 10.0; Res_ohm: 10; Value_Code: 10R0; Tolerance_%: 1; Power_W: 0.25; Value2: 0.25W; VDC_V: 200; TempCo: 200 ppm/C; SizeArea_mm2: 5.12; SizeX_mm: 3.2; SizeY_mm: 1.6; SizeZ_mm: 1.35; EIA_Code: E96; U/M: EA; AEC Category: Q200; SymbolVersion: 2009-05-29; PartNumber: RC1206FR-0710RL; PackageReference: 1206; RoHS: Y; Value1: 1%; MountType: SMT; Technology: Thick Film; Published: 2008-06-26; Publisher: Texas Instruments; LatestRevisionDate: 2017-03-10; ComponentLink1Description: Datasheet link; ComponentLink1URL: http://www.yageo.com/pdf/Pu-RC1206_51_PbFree_L_2.pdf; Supplier 1: Digi-Key; Supplier Part Number 1: 311-10.0FRCT-ND; Supplier 2: Mouser; Supplier Part Number 2: 603-RC1206FR-0710RL; Supplier 3: Farnell; Supplier Part Number 3: 9236643; AEC Qualified: ?
R31 = WSL36371L000FEA: RES, 0.002, 1%, 3 W, WSL3637; Manufacturer: Vishay-Dale; CompType: Resistor; Value: 0.002; Value_Code: 2L000; Tolerance_%: 1; Power_W: 3; Value2: 3W; VDC_V: 0; TempCo: 75 ppm/C; EIA_Code: E96; U/M: EA; AEC Category: Q200; SymbolVersion: 2009-05-29; PartNumber: WSL36372L000FEA; PackageReference: WSL3637; RoHS: Y; Res_ohm: 0.002; Value1: 1%; MountType: SMT; Technology: Metal Film; Published: 2008-06-26; Publisher: Texas Instruments; LatestRevisionDate: 2016-09-24; ComponentLink1Description: Datasheet link; ComponentLink1URL: http://www.vishay.com/docs/30099/wsl3637.pdf; Supplier 1: Mouser; Supplier Part Number 1: 71-WSL36372L000FEA; Supplier 2: Newark; Supplier Part Number 2: 46P3685; AEC Qualified: ?
R32 R33 R38 R87 R155 R174 R180 R182 = RC0603FR-0710RL: RES, 10.0, 1%, 0.1 W, 0603; Manufacturer: Yageo America; CompType: Resistor; Value: 10.0; Res_ohm: 10; Value_Code: 10R0; Tolerance_%: 1; Power_W: 0.1; Value2: 0.1W; VDC_V: 150; TempCo: 200 ppm/C; SizeArea_mm2: 1.28; SizeX_mm: 1.6; SizeY_mm: 0.8; EIA_Code: E96; U/M: EA; AEC Category: Q200; SymbolVersion: 2009-05-29; PartNumber: RC0603FR-0710RL; PackageReference: 0603; RoHS: Y; Value1: 1%; MountType: SMT; Technology: Thick Film; SizeZ_mm: 1; Published: 2008-06-26; Publisher: Texas Instruments; LatestRevisionDate: 2016-09-18; ComponentLink1Description: Datasheet link; ComponentLink1URL: http://www.yageo.com/pdf/Pu-RC0603_51_PbFree_L_2.pdf; Supplier 1: Digi-Key; Supplier Part Number 1: 311-10.0HRCT-ND; Supplier 2: Mouser; Supplier Part Number 2: 603-RC0603FR-0710RL; Supplier 3: Farnell; Supplier Part Number 3: 9238247; AEC Qualified: ?
R35 R177 = ERJ-8ENF10R0V: RES, 10.0, 1%, 0.25 W, 1206; Manufacturer: Panasonic; CompType: Resistor; Res_ohm: 10; Value_Code: 10R0; Tolerance_%: 1; Power_W: 0.25; Value2: 0.25W; VDC_V: 200; TempCo: 100 ppm/C; EIA_Code: E96; U/M: EA; ValueDisplayed: 10.0; SymbolVersion: 2009-05-29; PartNumber: ERJ-8ENF10R0V; PackageReference: 1206; RoHS: Y; Value1: 1%; MountType: SMT; Technology: Thick Film; Published: 2008-06-26; Publisher: Texas Instruments; LatestRevisionDate: 2014-09-18; ComponentLink1Description: Datasheet link; ComponentLink1URL: http://www.panasonic.com/industrial/components/pdf/AOA0000CE2.pdf; Supplier 1: Digi-Key; Supplier Part Number 1: P10.0FCT-ND; Supplier 2: Farnell; Supplier Part Number 2: 1748406
R36 = CMP-0022109-5: RES, 1.00 k, 1%, 0.1 W, AEC-Q200 Grade 0, 0603; PartNumber: CRCW06031K00FKEA; Manufacturer: Vishay-Dale; Value: 1.00k; Res_ohm: 1k; Value_Code: 1k00; Power_W: 100mW; Value2: 0.1W; VDC_V: 75V; TempCo: 100 ppm/C; EIA_Code: E96; AEC Category: Q200; AEC Qualified: Y; AEC Grade: 0; SizeArea_mm2: 1.28; SizeX_mm: 1.6; SizeY_mm: 0.8; SizeZ_mm: 1; CompType: Resistor; PackageReference: 0603; RoHS: E; Tolerance_%: 1%; Value1: 1%; MountType: SMT; Technology: Thick Film; ComponentLink1Description: Datasheet link; ComponentLink1URL: http://www.vishay.com/docs/20035/dcrcwe3.pdf; Supplier 1: Digi-Key; Supplier Part Number 1: 541-1.00KHCT-ND; Supplier 2: Newark; Supplier Part Number 2: 52K8015; Supplier 3: Mouser; Supplier Part Number 3: 71-CRCW0603-1.0K-E3
R43 = CRCW060347R0JNEA: RES, 47, 5%, 0.1 W, 0603; Manufacturer: Vishay-Dale; CompType: Resistor; Value: 47; Value_Code: 47R0; Tolerance_%: 5; Power_W: 0.1; Value2: 0.1W; VDC_V: 75; TempCo: 200 ppm/C; SizeArea_mm2: 1.28; SizeX_mm: 1.6; SizeY_mm: 0.8; SizeZ_mm: 1; EIA_Code: E24; U/M: EA; AEC Category: Q200; SymbolVersion: 2009-05-29; PartNumber: CRCW060347R0JNEA; PackageReference: 0603; RoHS: Y; Res_ohm: 47; Value1: 5%; MountType: SMT; Technology: Thick Film; Published: 2008-06-26; Publisher: Texas Instruments; LatestRevisionDate: 2017-03-04; ComponentLink1Description: Datasheet link; ComponentLink1URL: http://www.vishay.com/docs/20035/dcrcwe3.pdf; Supplier 1: Digi-Key; Supplier Part Number 1: 541-47GCT-ND; Supplier 2: Newark; Supplier Part Number 2: 52K8552; Supplier 3: Mouser; Supplier Part Number 3: 71-CRCW0603J-47-E3; AEC Qualified: ?
R60 R61 = CMP-0022446-5: RES, 499, 1%, 0.1 W, AEC-Q200 Grade 0, 0603; PartNumber: CRCW0603499RFKEA; Manufacturer: Vishay-Dale; Value: 499; Value_Code: 499R; Power_W: 100mW; Value2: 0.1W; VDC_V: 75V; TempCo: 100 ppm/C; SizeArea_mm2: 1.28; SizeX_mm: 1.6; SizeY_mm: 0.8; SizeZ_mm: 1; EIA_Code: E96; AEC Category: Q200; AEC Qualified: Y; AEC Grade: 0; CompType: Resistor; PackageReference: 0603; RoHS: E; Res_ohm: 499; Tolerance_%: 1%; Value1: 1%; MountType: SMT; Technology: Thick Film; ComponentLink1Description: Datasheet link; ComponentLink1URL: http://www.vishay.com/docs/20035/dcrcwe3.pdf; Supplier 1: Digi-Key; Supplier Part Number 1: 541-499HCT-ND; Supplier 2: Newark; Supplier Part Number 2: 52K8569; Supplier 3: Mouser; Supplier Part Number 3: 71-CRCW0603-499-E3
R88 R92 R95 R96 R173 R176 R184 = RC0603FR-071KL: RES, 1.00 k, 1%, 0.1 W, 0603; Manufacturer: Yageo America; CompType: Resistor; Value: 1.00k; Res_ohm: 1000; Value_Code: 1k00; Tolerance_%: 1; Power_W: 0.1; Value2: 0.1W; VDC_V: 150; TempCo: 200 ppm/C; SizeArea_mm2: 1.28; SizeX_mm: 1.6; SizeY_mm: 0.8; EIA_Code: E96; U/M: EA; AEC Category: Q200; SymbolVersion: 2009-05-29; PartNumber: RC0603FR-071KL; PackageReference: 0603; RoHS: Y; Value1: 1%; MountType: SMT; Technology: Thick Film; SizeZ_mm: 1; Published: 2008-06-26; Publisher: Texas Instruments; LatestRevisionDate: 2017-03-04; ComponentLink1Description: Datasheet link; ComponentLink1URL: http://www.yageo.com/pdf/Pu-RC0603_51_PbFree_L_2.pdf; Supplier 1: Digi-Key; Supplier Part Number 1: 311-1.00KHRCT-ND; Supplier 2: Mouser; Supplier Part Number 2: 603-RC0603FR-071KL; Supplier 3: Farnell; Supplier Part Number 3: 9238484; AEC Qualified: ?
R101 = RC0603FR-07330RL: RES, 330, 1%, 0.1 W, 0603; Manufacturer: Yageo America; CompType: Resistor; Value: 330; Value_Code: 330R; Tolerance_%: 1; Power_W: 0.1; Value2: 0.1W; VDC_V: 150; TempCo: 200 ppm/C; SizeArea_mm2: 1.28; SizeX_mm: 1.6; SizeY_mm: 0.8; U/M: EA; AEC Category: Q200; SymbolVersion: 2009-05-29; PartNumber: RC0603FR-07330RL; PackageReference: 0603; RoHS: Y; Res_ohm: 330; Value1: 1%; MountType: SMT; Technology: Thick Film; SizeZ_mm: 1; Published: 2008-06-26; Publisher: Texas Instruments; LatestRevisionDate: 2017-03-04; ComponentLink1Description: Datasheet link; ComponentLink1URL: http://www.yageo.com/pdf/Pu-RC0603_51_PbFree_L_2.pdf; Supplier 1: Digi-Key; Supplier Part Number 1: 311-330HRCT-ND; Supplier 2: Mouser; Supplier Part Number 2: 603-RC0603FR-07330RL; Supplier 3: Farnell; Supplier Part Number 3: 9238425; AEC Qualified: ?
R102 R104 = CRCW0603499RFKEA: RES, 499, 1%, 0.1 W, 0603; Manufacturer: Vishay-Dale; CompType: Resistor; Value: 499; Value_Code: 499R; Tolerance_%: 1; Power_W: 0.1; Value2: 0.1W; VDC_V: 75; TempCo: 100 ppm/C; SizeArea_mm2: 1.28; SizeX_mm: 1.6; SizeY_mm: 0.8; EIA_Code: E96; U/M: EA; AEC Category: Q200; Green_Lifecycle: Active; Green_REACh: Passed; SymbolVersion: 2009-05-29; PartNumber: CRCW0603499RFKEA; PackageReference: 0603; RoHS: Y; Res_ohm: 499; Value1: 1%; MountType: SMT; Technology: Thick Film; SizeZ_mm: 1; Published: 2008-06-26; Publisher: Texas Instruments; LatestRevisionDate: 2017-05-31; ComponentLink1Description: Datasheet link; ComponentLink1URL: http://www.vishay.com/docs/20035/dcrcwe3.pdf; Supplier 1: Digi-Key; Supplier Part Number 1: 541-499HCT-ND; Supplier 2: Newark; Supplier Part Number 2: 52K8569; Supplier 3: Mouser; Supplier Part Number 3: 71-CRCW0603-499-E3; AEC Qualified: ?; Green_EU RoHS: Passed with Exemption; Green_EU RoHS-2: Passed
R110 = RC0603FR-0714KL: RES, 14.0 k, 1%, 0.1 W, 0603; Manufacturer: Yageo America; CompType: Resistor; Value: 14.0k; Res_ohm: 14000; Value_Code: 14k0; Tolerance_%: 1; Power_W: 0.1; Value2: 0.1W; VDC_V: 150; TempCo: 200 ppm/C; SizeArea_mm2: 1.28; SizeX_mm: 1.6; SizeY_mm: 0.8; EIA_Code: E96; U/M: EA; AEC Category: Q200; SymbolVersion: 2009-05-29; PartNumber: RC0603FR-0714KL; PackageReference: 0603; RoHS: Y; Value1: 1%; MountType: SMT; Technology: Thick Film; SizeZ_mm: 1; Published: 2008-06-26; Publisher: Texas Instruments; LatestRevisionDate: 2016-09-18; ComponentLink1Description: Datasheet link; ComponentLink1URL: http://www.yageo.com/pdf/Pu-RC0603_51_PbFree_L_2.pdf; Supplier 1: Digi-Key; Supplier Part Number 1: 311-14.0KHRCT-ND; Supplier 2: Mouser; Supplier Part Number 2: 603-RC0603FR-0714KL; AEC Qualified: ?
R157 R159 = CMP-0021991-4: RES, 100, 1%, 0.1 W, AEC-Q200 Grade 0, 0603; PartNumber: CRCW0603100RFKEA; Manufacturer: Vishay-Dale; Value: 100; Value_Code: 100R; Power_W: 100mW; Value2: 0.1W; VDC_V: 75V; TempCo: 100 ppm/C; EIA_Code: E96; AEC Category: Q200; AEC Qualified: Y; AEC Grade: 0; SizeArea_mm2: 1.28; SizeX_mm: 1.6; SizeY_mm: 0.8; SizeZ_mm: 1; CompType: Resistor; PackageReference: 0603; RoHS: E; Res_ohm: 100; Tolerance_%: 1%; Value1: 1%; MountType: SMT; Technology: Thick Film; ComponentLink1Description: Datasheet link; ComponentLink1URL: http://www.vishay.com/docs/20035/dcrcwe3.pdf; Supplier 1: Digi-Key; Supplier Part Number 1: 541-100HCT-ND; Supplier 2: Newark; Supplier Part Number 2: 52K8078; Supplier 3: Mouser; Supplier Part Number 3: 71-CRCW0603-100-E3
R158 = RC0603JR-070RL: RES, 0, 5%, 0.1 W, 0603; Manufacturer: Yageo America; CompType: Resistor; Value: 0; Value_Code: 0000; Tolerance_%: 5; Power_W: 0.1; Value2: 0.1W; VDC_V: 50; TempCo: 200 ppm/C; SizeArea_mm2: 1.28; SizeX_mm: 1.6; SizeY_mm: 0.8; SizeZ_mm: 1; EIA_Code: E24; U/M: EA; AEC Category: Q200; SymbolVersion: 2009-05-29; PartNumber: RC0603JR-070RL; PackageReference: 0603; RoHS: Y; Res_ohm: 0; Value1: 5%; MountType: SMT; Technology: Thick Film; Published: 2008-06-26; Publisher: Texas Instruments; LatestRevisionDate: 2016-09-18; ComponentLink1Description: Datasheet link; ComponentLink1URL: http://www.yageo.com/pdf/Pu-RC0603_51_PbFree_L_2.pdf; Supplier 1: Digi-Key; Supplier Part Number 1: 311-0.0GRCT-ND; Supplier 2: Mouser; Supplier Part Number 2: 603-RC0603JR-070RL; Supplier 3: Farnell; Supplier Part Number 3: 9233130; AEC Qualified: ?
R179 R181 = RC0603FR-072K2L: RES, 2.20 k, 1%, 0.1 W, 0603; Manufacturer: Yageo America; CompType: Resistor; Value: 2.20k; Res_ohm: 2200; Value_Code: 2k20; Tolerance_%: 1; Power_W: 0.1; Value2: 0.1W; VDC_V: 150; TempCo: 200 ppm/C; SizeArea_mm2: 1.28; SizeX_mm: 1.6; SizeY_mm: 0.8; U/M: EA; AEC Category: Q200; SymbolVersion: 2009-05-29; PartNumber: RC0603FR-072K2L; PackageReference: 0603; RoHS: Y; Value1: 1%; MountType: SMT; Technology: Thick Film; SizeZ_mm: 1; Published: 2008-06-26; Publisher: Texas Instruments; LatestRevisionDate: 2017-03-04; ComponentLink1Description: Datasheet link; ComponentLink1URL: http://www.yageo.com/pdf/Pu-RC0603_51_PbFree_L_2.pdf; Supplier 1: Digi-Key; Supplier Part Number 1: 311-2.20KHRCT-ND; Supplier 2: Mouser; Supplier Part Number 2: 603-RC0603FR-072K2L; Supplier 3: Farnell; Supplier Part Number 3: 9238522; AEC Qualified: ?
R183 = RC0603FR-0775KL: RES, 75.0 k, 1%, 0.1 W, 0603; Manufacturer: Yageo America; CompType: Resistor; Value: 75.0k; Res_ohm: 75000; Value_Code: 75k0; Tolerance_%: 1; Power_W: 0.1; Value2: 0.1W; VDC_V: 150; TempCo: 200 ppm/C; SizeArea_mm2: 1.28; SizeX_mm: 1.6; SizeY_mm: 0.8; EIA_Code: E96; U/M: EA; AEC Category: Q200; SymbolVersion: 2009-05-29; PartNumber: RC0603FR-0775KL; PackageReference: 0603; RoHS: Y; Value1: 1%; MountType: SMT; Technology: Thick Film; SizeZ_mm: 1; Published: 2008-06-26; Publisher: Texas Instruments; LatestRevisionDate: 2017-03-04; ComponentLink1Description: Datasheet link; ComponentLink1URL: http://www.yageo.com/pdf/Pu-RC0603_51_PbFree_L_2.pdf; Supplier 1: Digi-Key; Supplier Part Number 1: 311-75.0KHRCT-ND; Supplier 2: Mouser; Supplier Part Number 2: 603-RC0603FR-0775KL; Supplier 3: Farnell; Supplier Part Number 3: 1799354; AEC Qualified: ?
U6 = CMP-0079943-1: 50-uV Offset, 7-nV/√Hz Noise, Low-Power, Precision Instrumentation Amplifier, D0008A (SOIC-8); Alternate PartNumber: INA828IDR; Alternate Manufacturer: Texas Instruments; SizeAreaWB_mm2: 56.58; SizeZ_mm: 1.75; SizeX_mm: 4.9; SizeY_mm: 6.2; SizeArea_mm2: 30.38; CompType: IC; AEC Qualified: N; AEC Category: Q200; ComponentLink1URL: http://www.ti.com/lit/ds/symlink/ina828.pdf; PackageDescription: SOIC-8; RoHS: Y; MountType: SMT; ComponentLink2URL: http://www.ti.com/product/ina828; ComponentLink3Description: Online Datasheet; ComponentLink2Description: Product Folder; Manufacturer: Texas Instruments; ComponentLink3URL: http://www.ti.com/product/ina828/datasheet; PackageReference: D0008A; PartNumber: INA828ID; ComponentLink1Description: Datasheet Link
U8 = TL331IDBVR: SINGLE DIFFERENTIAL COMPARATOR, DBV0005A (SOT-5); Manufacturer: Texas Instruments; Alternate PartNumber: TL331IDBVT; SymbolCreator: a0411947; SizeArea_mm2: 8.12; SizeAreaWB_mm2: 14.82; SizeX_mm: 2.8; SizeY_mm: 2.9; SizeZ_mm: 1.45; CompType: IC; U/M: EA; ComponentLink1URL: http://www.ti.com/lit/ds/symlink/tl331.pdf; SymbolVersion: 2013-02-27; PackageReference: DBV0005A; PartNumber: TL331IDBVR; Alternate Manufacturer: Texas Instruments; ComponentLink1Description: Datasheet Link; PackageDescription: SOT-5; MountType: SMT; RoHS: Y; Publisher: Texas Instruments; LatestRevisionDate: 2016-09-25
U9 = OPA180IDR: 0.1-uV/degC Drift, Low-Noise, Rail-to-Rail Output, 36-V, Zero-Drift Operational Amplifiers, D0008A (SOIC-8); Manufacturer: Texas Instruments; SymbolCreator: a0411595/a0412235; SizeArea_mm2: 30.38; SizeAreaWB_mm2: 56.58; SizeX_mm: 4.9; SizeY_mm: 6.2; SizeZ_mm: 1.75; CompType: IC; U/M: EA; PartNumber: OPA180IDR; Alternate PartNumber: OPA180ID; PackageReference: D0008A; PackageDescription: SOIC-8; MountType: SMT; ComponentLink1Description: Datasheet Link; ComponentLink1URL: http://www.ti.com/lit/ds/symlink/opa180.pdf; Alternate Manufacturer: Texas Instruments; SymbolVersion: 2015-01-07; RoHS: Y; Publisher: Texas Instruments; LatestRevisionDate: 2016-09-25
U15 U33 = CMP-0272-01189-3: 0.1 uV/degC Drift, Low Noise, Rail-to-Rail Output, Zero-Drift Operational Amplifier, 4 to 36 V, -40 to 125 degC, 8-pin SOP (DGK8), Green (RoHS & no Sb/Br); Manufacturer: Texas Instruments; CMRR(Min)(dB): 104; Iq per channel(Max)(mA): 0.525; Total Supply Voltage(Max)(+5V is 5, +/-5V is 10): 36; Vio (25C)(Max)(mV): 0.075; Sub Family: High Supply Voltage Amplifier (>=30V), Low Noise Amp (<=10nV/rtHz), Precision Amplifier, Zero Drift Precision Amplifier; Total Supply Voltage(Min)(+5V is 5, +/-5V is 10): 4; Offset Drift(Typ)(uV/C): 0.1; Rating: Catalog; GBW(Typ)(MHz): 2; Slew Rate(Typ)(V/us): 0.8; IIB(Max)(pA): 1000; Packing: LARGE T&R; Eco-Plan: Green (RoHS & no Sb/Br); PackageDescription: 8-Pin Thin Small Outline, Body 3 x 3 mm, Pitch 0.65 mm; ComponentLink3URL: http://www.ti.com/litv/pdf/mpds028d; Mounting Technology: Surface Mount; ComponentLink2Description: Datasheet; ComponentLink3Description: Package Specification; PartNumber: OPA2180IDGKR; ComponentLink2URL: http://www.ti.com/lit/ds/symlink/opa2180.pdf; Number of Channels: 2; DatasheetVersion: SBOS584C; ComponentLink1Description: Manufacturer URL; PackageVersion: 4073329/E, 05/2006; PackageReference: DGK0008A; ComponentLink1URL: http://www.ti.com/; Code_JEDEC: MO-187
U19 = CMP-2000-05026-1: Intelligent Control LED Integrated Light Source, 3.5 to 5.3 V, -25 to 80 degC, 4-Pin SMD, RoHS, Tape and Reel; Manufacturer: Adafruit-Industries-LLC; Number of LEDs: 10; Configuration: Discrete; Utilized LED: WS2812(5050); Datasheet URL: http://datasheet.octopart.com/ADA1655-Adafruit-Industries-datasheet-32028139.pdf; Series: Neopixel; Interface: -; Package Description: 4-Pin Surface Mount Device, Body 5 x 5 mm; Color: Red,Green,Blue(RGB); Category: Optoelectronics; Controller Type: -; Package Reference: 1655; Manufacturer URL: https://www.adafruit.com/; Mounting Type: SurfaceMount; Datasheet Version: May-13; Size / Dimension: 5.00mmLx5.00mmW; Family: Addressable,Specialty
U30 = CMP-0063-01354-3: 100V Half-Bridge Gate Driver with Programmable Dead-Time, 10-pin MSOP, Pb-Free; Manufacturer: Texas Instruments; PackageTopMarking: ZXTT*5106; PowerWise: N; CompType: MiscPower; PinCount: 10; Code_JEDEC: MO-187-BA; PackageReference: DGS0010A; PackageDescription: Mini-SO, Molded, .118 x .118 x .034in Body, 10 Lead, .0197in Pitch; ComponentLink1URL: http://www.ti.com/general/docs/lit/getliterature.tsp?genericPartNumber=LM5106&fileType=pdf; ComponentLink1Description: Datasheet URL; RoHS: Y
U31 = CMP-0319-01218-2: Pulse-Width-Modulation Control Circuit with Voltage Control, 45 % Duty Cycle, 0 to +70 degC, 16-pin TSSOP (PW), Green (RoHS & no Sb/Br); Manufacturer: Texas Instruments; Duty Cycle(Max)(%): 45; Rating: Catalog; SubFamily: PWM Controller; Regulated Outputs(#): 2; Frequency(Max)(kHz): 300; Topology: Boost, Flyback, Forward; Control Method: Voltage; PackageVersion: revG, Feb-2011; Code_JEDEC: MO-153; Mounting Technology: Surface Mount; DatasheetVersion: SLVS052G; Eco-Plan: Green (RoHS & no Sb/Br); ComponentLink1Description: Datasheet; PackageReference: PW0016A; ComponentLink1URL: http://www.ti.com/general/docs/lit/getliterature.tsp?genericPartNumber=TL594&fileType=pdf; PartNumber: TL594CPWR; UVLO Thresholds On/Off(V): 6.1/6; PackageDescription: 16-Pin Plastic Thin Small Outline Package 5 x 4.4 mm Body ,0.65 mm Pitch